# Altium schematic sheet Nucleo.SchDoc
size A4
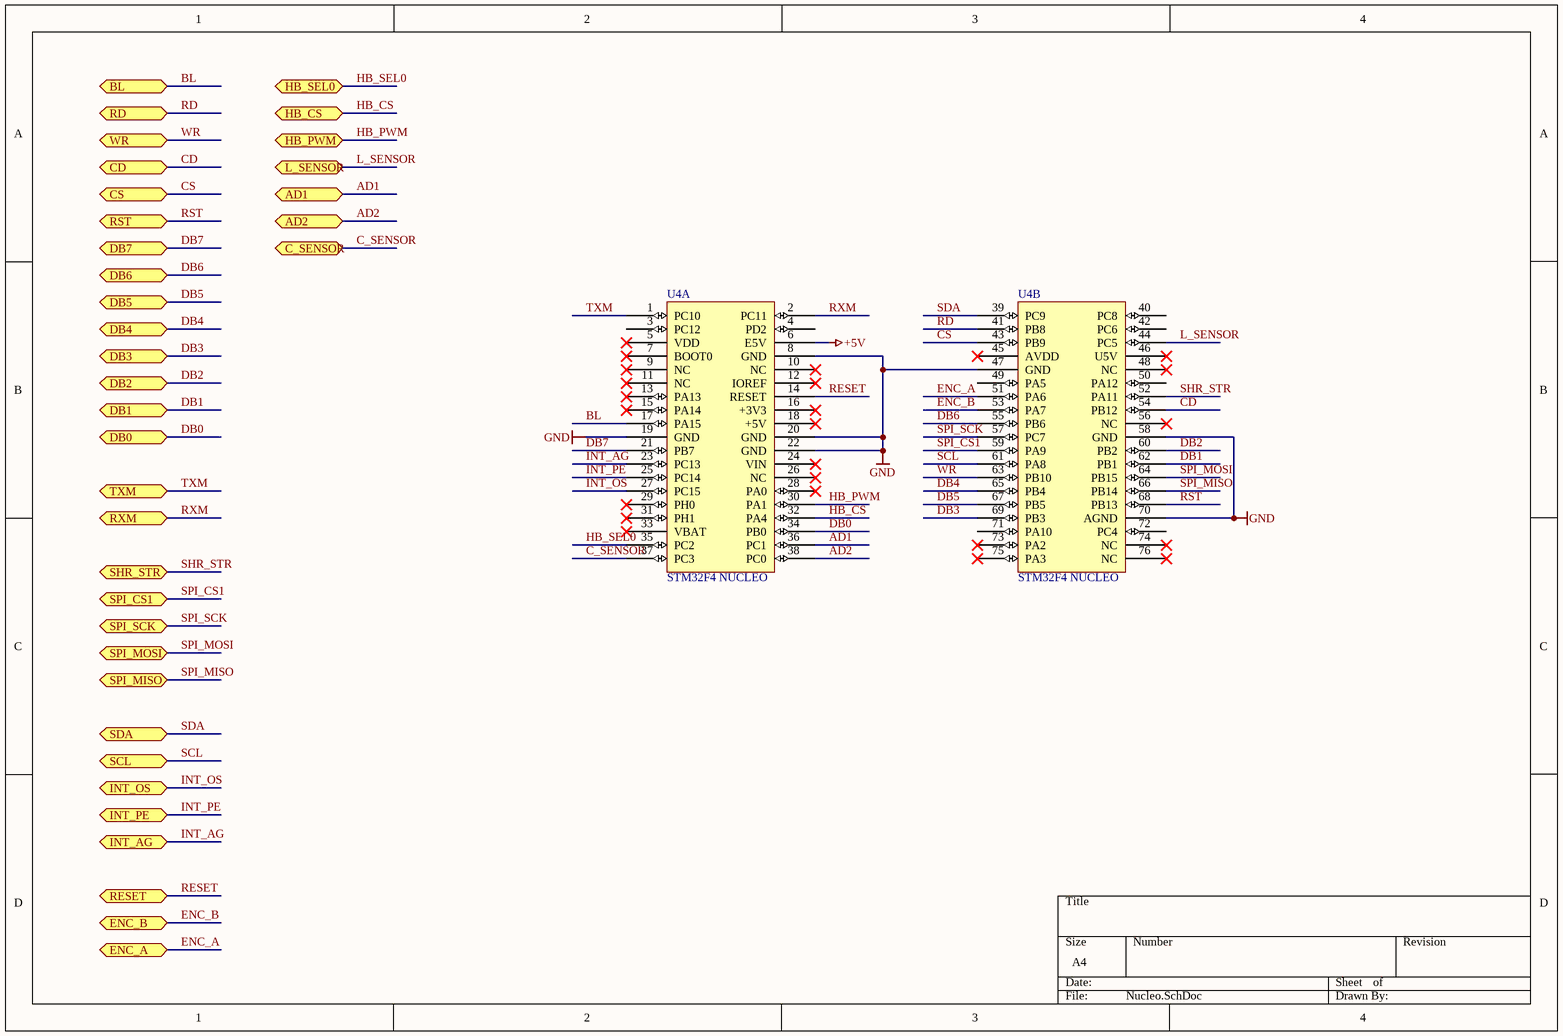
[diagram p0: Nucleo.SchDoc]

## Parts
U4  STM32F4 NUCLEO  [STM32F4xx_Nucleo]  (parts A,B of 2)

## Ports
AD1 (bidir), AD2 (bidir), BL (bidir), C_SENSOR (bidir), CD (bidir), CS (bidir), DB0 (bidir), DB1 (bidir), DB2 (bidir), DB3 (bidir), DB4 (bidir), DB5 (bidir), DB6 (bidir), DB7 (bidir), ENC_A (bidir), ENC_B (bidir), HB_CS (bidir), HB_PWM (bidir), HB_SEL0 (bidir), INT_AG (bidir), INT_OS (bidir), INT_PE (bidir), L_SENSOR (bidir), RD (bidir), RESET (bidir), RST (bidir), RXM (bidir), SCL (bidir), SDA (bidir), SHR_STR (bidir), SPI_CS1 (bidir), SPI_MISO (bidir), SPI_MOSI (bidir), SPI_SCK (bidir), TXM (bidir), WR (bidir)

## Nets
+5V: U4.6(E5V)
GND: U4.8(GND) U4.19(GND) U4.20(GND) U4.22(GND) U4.47(GND) U4.58(GND) U4.70(AGND)
AD1: U4.36(PC1) ; port AD1
AD2: U4.38(PC0) ; port AD2
BL: U4.17(PA15) ; port BL
C_SENSOR: U4.37(PC3) ; port C_SENSOR
CD: U4.54(PB12) ; port CD
CS: U4.43(PB9) ; port CS
DB0: U4.34(PB0) ; port DB0
DB1: U4.62(PB1) ; port DB1
DB2: U4.60(PB2) ; port DB2
DB3: U4.69(PB3) ; port DB3
DB4: U4.65(PB4) ; port DB4
DB5: U4.67(PB5) ; port DB5
DB6: U4.55(PB6) ; port DB6
DB7: U4.21(PB7) ; port DB7
ENC_A: U4.51(PA6) ; port ENC_A
ENC_B: U4.53(PA7) ; port ENC_B
HB_CS: U4.32(PA4) ; port HB_CS
HB_PWM: U4.30(PA1) ; port HB_PWM
HB_SEL0: U4.35(PC2) ; port HB_SEL0
INT_AG: U4.23(PC13) ; port INT_AG
INT_OS: U4.27(PC15) ; port INT_OS
INT_PE: U4.25(PC14) ; port INT_PE
L_SENSOR: U4.44(PC5) ; port L_SENSOR
RD: U4.41(PB8) ; port RD
RESET: U4.14(RESET) ; port RESET
RST: U4.68(PB13) ; port RST
RXM: U4.2(PC11) ; port RXM
SCL: U4.61(PA8) ; port SCL
SDA: U4.39(PC9) ; port SDA
SHR_STR: U4.52(PA11) ; port SHR_STR
SPI_CS1: U4.59(PA9) ; port SPI_CS1
SPI_MISO: U4.66(PB14) ; port SPI_MISO
SPI_MOSI: U4.64(PB15) ; port SPI_MOSI
SPI_SCK: U4.57(PC7) ; port SPI_SCK
TXM: U4.1(PC10) ; port TXM
WR: U4.63(PB10) ; port WR

Not connected (* = marked no-connect by the designer): U4 3(PC12) 4(PD2) 5(VDD)* 7(BOOT0)* 9(NC)* 10(NC)* 11(NC)* 12(IOREF)* 13(PA13)* 15(PA14)* 16(+3V3)* 18(+5V)* 24(VIN)* 26(NC)* 28(PA0)* 29(PH0)* 31(PH1)* 33(VBAT)* 40(PC8) 42(PC6) 45(AVDD)* 46(U5V)* 48(NC)* 49(PA5) 50(PA12) 56(NC)* 71(PA10) 72(PC4) 73(PA2)* 74(NC)* 75(PA3)* 76(NC)*

## Library data of the parts
U4 = NUCLEO-F446RE: STM32F4xx Nucleo board; Name: STM32F4 NUCLEO; Datasheet: https://www.st.com/content/ccc/resource/technical/document/user_manual/98/2e/fa/4b/e0/82/43/b7/DM00105823.pdf/files/DM00105823.pdf/jcr:content/translations/en.DM00105823.pdf